# EAGLE design algyan-6th-03 (EAGLE 9.6.2)
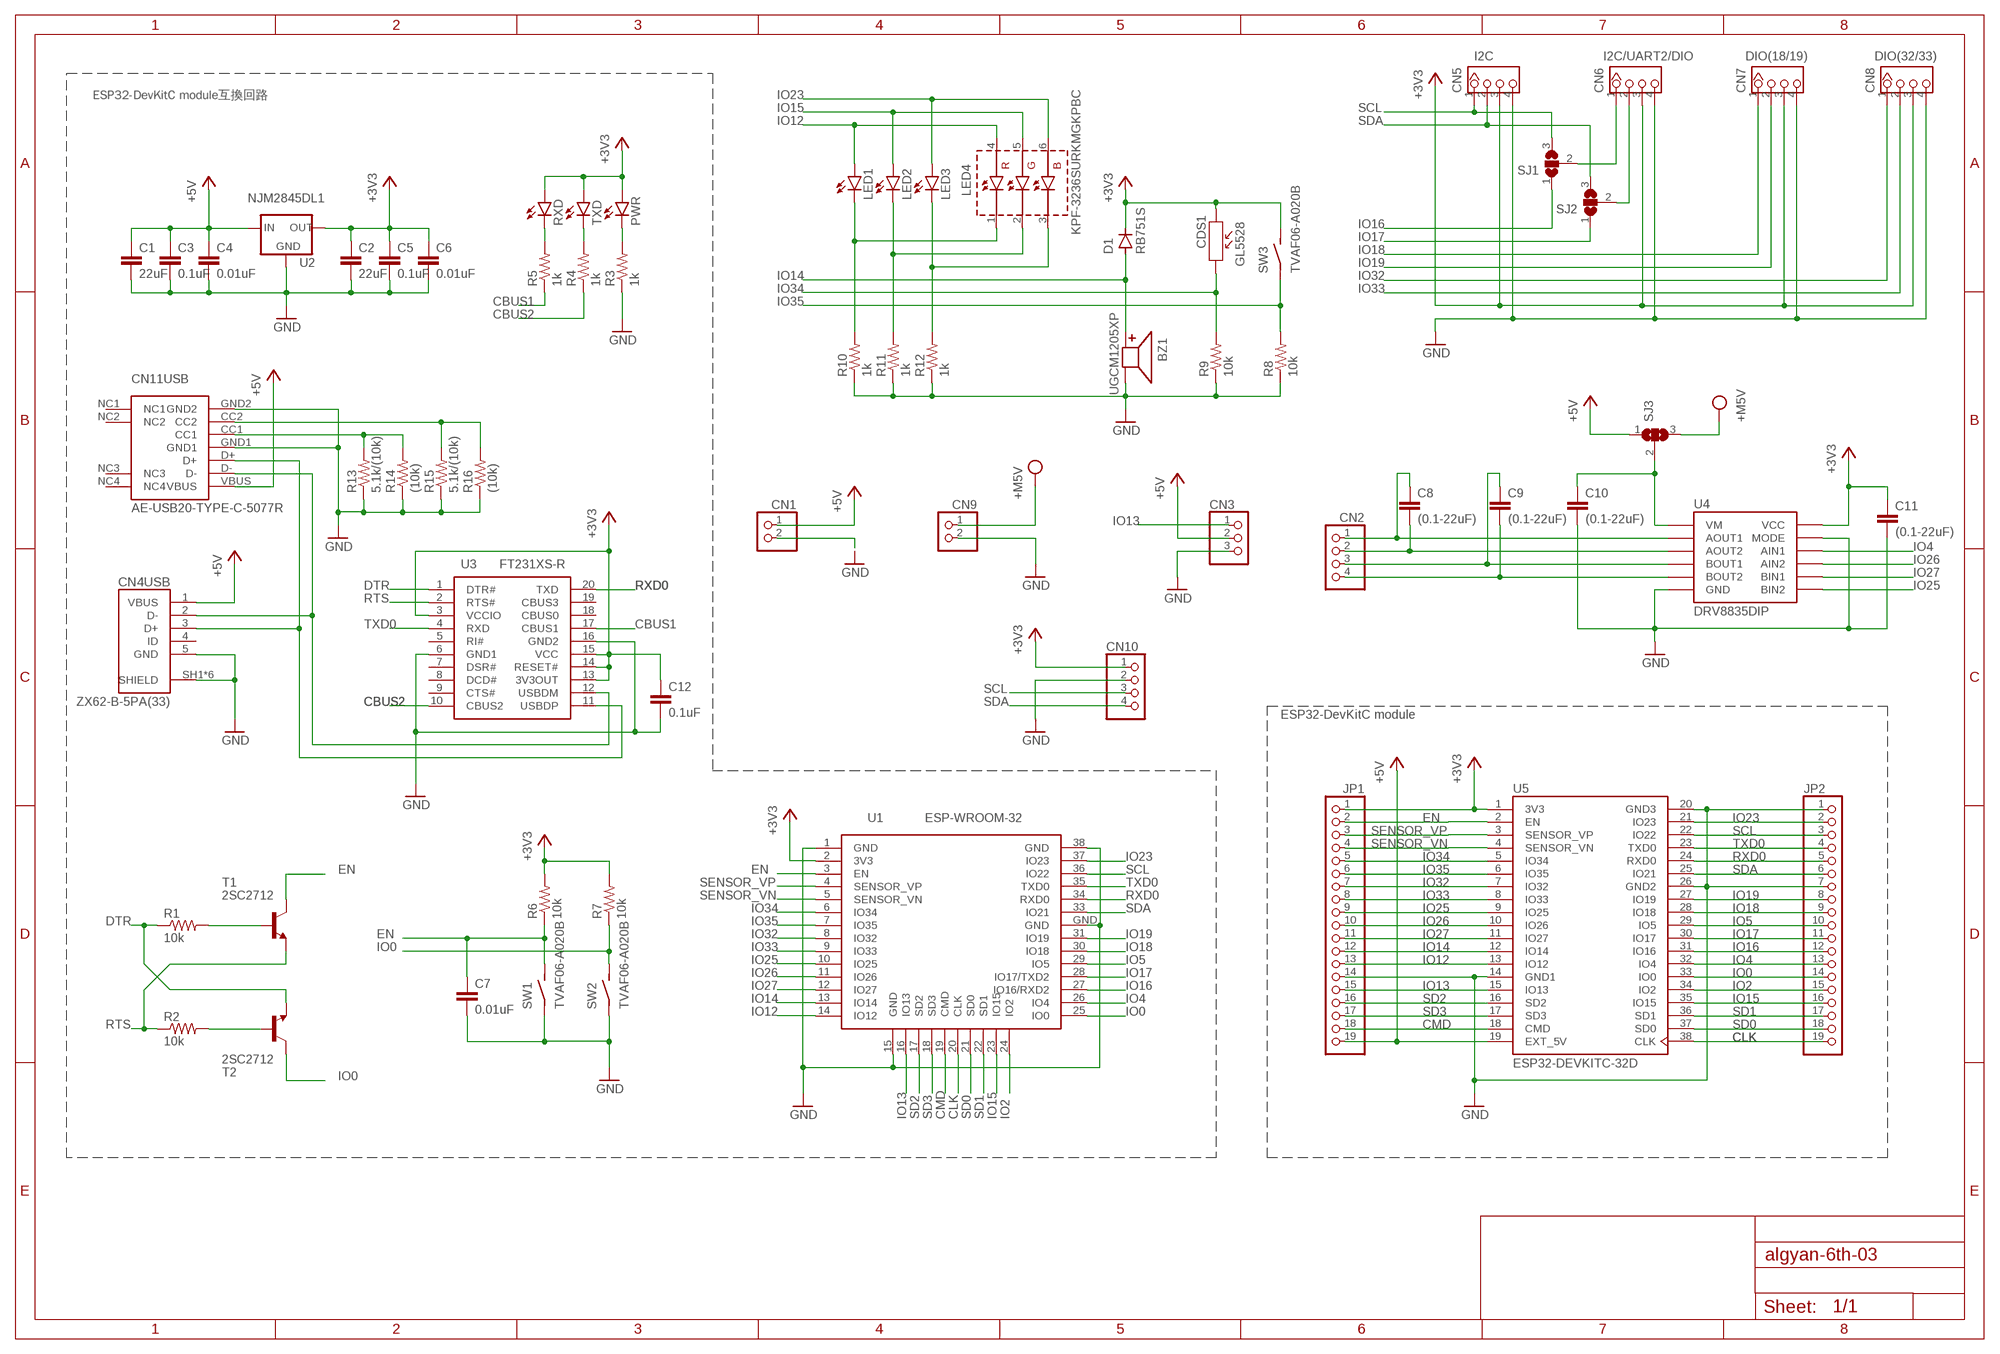
[diagram p0: schematic, sheet 1]

## Parts
BZ1  UGCM1205XP  [UGCM1205XP]
C1  22uF  C-EUC3216  [C3216]
C2  22uF  C-EUC3216  [C3216]
C3  0.1uF  C-EUC2012  [C2012]
C4  0.01uF  C-EUC1608  [C1608]
C5  0.1uF  C-EUC2012  [C2012]
C6  0.01uF  C-EUC1608  [C1608]
C7  0.01uF  C-EUC1608  [C1608]
C8  (0.1-22uF)  C-EUC3216  [C3216]
C9  (0.1-22uF)  C-EUC3216  [C3216]
C10  (0.1-22uF)  C-EUC3216  [C3216]
C11  (0.1-22uF)  C-EUC3216  [C3216]
C12  0.1uF  C-EUC2012  [C2012]
CDS1  GL5528  [GL5528]
CN1  PINHD-1X2  [1X02]
CN2  PINHD-1X4  [1X04]
CN3  PINHD-1X3  [1X03]
CN4USB  ZX62-B-5PA(33)  [HRS_ZX62-B-5PA(33)]
CN5  I2C  GROVE-CONNECTOR-DIP(4P-2.0)  [HW4-2.0]
CN6  I2C/UART2  GROVE-CONNECTOR-DIP(4P-2.0)  [HW4-2.0]
CN7  DIO(18/19)  GROVE-CONNECTOR-DIP(4P-2.0)  [HW4-2.0]
CN8  DIO(32/33)  GROVE-CONNECTOR-DIP(4P-2.0)  [HW4-2.0]
CN9  PINHD-1X2  [1X02]
CN10  PINHD-1X4/90  [1X04/90]
CN11USB  AE-USB20-TYPE-C-5077R  [AE-USB20-TYPE-C-5077R]
D1  RB751S  [SOD-523]
JP1  PINHD-1X19  [1X19]
JP2  PINHD-1X19  [1X19]
LED1  LEDCHIPLED_0805  [CHIPLED_0805]
LED2  LEDCHIPLED_0805  [CHIPLED_0805]
LED3  LEDCHIPLED_0805  [CHIPLED_0805]
LED4  KPF-3236SURKMGKPBC  [KPF-3236SURKMGKPBC]
PWR  LEDCHIPLED_0805  [CHIPLED_0805]
R1  10k  R-US_R2012  [R2012]
R2  10k  R-US_R2012  [R2012]
R3  1k  R-US_R2012  [R2012]
R4  1k  R-US_R2012  [R2012]
R5  1k  R-US_R2012  [R2012]
R6  10k  R-US_R2012  [R2012]
R7  10k  R-US_R2012  [R2012]
R8  10k  R-US_R2012  [R2012]
R9  10k  R-US_R2012  [R2012]
R10  1k  R-US_R2012  [R2012]
R11  1k  R-US_R2012  [R2012]
R12  1k  R-US_R2012  [R2012]
R13  5.1k/(10k)  R-US_R2012  [R2012]
R14  (10k)  R-US_R2012  [R2012]
R15  5.1k/(10k)  R-US_R2012  [R2012]
R16  (10k)  R-US_R2012  [R2012]
RXD  LEDCHIPLED_0805  [CHIPLED_0805]
SJ1  SJ2W  [SJ_2]
SJ2  SJ2W  [SJ_2]
SJ3  SJ2W  [SJ_2]
SW1  TVAF06-A020B  [TVAF06-A020B]
SW2  TVAF06-A020B  [TVAF06-A020B]
SW3  TVAF06-A020B  [TVAF06-A020B]
T1  2SC2712  2SC2712YBC808SOT23-BEC  [SOT23-BEC]
T2  2SC2712  2SC2712YBC808SOT23-BEC  [SOT23-BEC]
TXD  LEDCHIPLED_0805  [CHIPLED_0805]
U1  ESP-WROOM-32  [ESP-WROOM-32]
U2  NJM2845DL1  [D-PAK_TO252AA]
U3  FT231XS-R  [SOP64P599X175-20N]
U4  DRV8835DIP  [DRV8835DIP]
U5  ESP32-DEVKITC-32D  [MODULE_ESP32-DEVKITC-32D]

## Nets
+3V3 [VDD]: C2.1 C5.1 C6.1 C11.1 C12.1 CDS1.1 CN5.3 CN6.3 CN7.3 CN8.3 CN10.1 D1.C JP1.1 PWR.A R6.2 R7.2 RXD.A SW3.2(S) TXD.A U1.2(3V3) U2.3(OUT) U3.3(VCCIO) U3.13(3V3OUT) U3.14(RESET#) U3.15(VCC) U4.VCC U5.1(3V3)
+5V [VDD]: C1.1 C3.1 C4.1 CN1.1 CN3.2 CN4USB.1(VBUS) CN11USB.VBUS JP1.19 SJ3.1 U2.1(IN) U5.19(EXT_5V)
CBUS1: R5.1 U3.17(CBUS1)
CBUS2: R4.1 U3.10(CBUS2)
CLK: JP2.19 U1.20(CLK) U5.38(CLK)
CMD: JP1.18 U1.19(CMD) U5.18(CMD)
DTR: R1.1 T2.E U3.1(DTR#)
EN: C7.1 JP1.2 R6.1 SW1.2(S) T1.C U1.3(EN) U5.2(EN)
GND [GND]: BZ1.P$2 C1.2 C2.2 C3.2 C4.2 C5.2 C6.2 C7.2 C10.2 C11.2 C12.2 CN1.2 CN3.3 CN4USB.5(GND) CN4USB.SH1(SHIELD) CN4USB.SH2(SHIELD) CN4USB.SH3(SHIELD) CN4USB.SH4(SHIELD) CN4USB.SH5(SHIELD) CN4USB.SH6(SHIELD) CN5.4 CN6.4 CN7.4 CN8.4 CN9.2 CN10.2 CN11USB.GND1 CN11USB.GND2 JP1.14 JP2.1 JP2.7 R3.1 R8.1 R9.1 R10.1 R11.1 R12.1 R13.1 R14.1 R15.1 R16.1 SW1.1(P) SW2.1(P) U1.1(GND) U1.15(GND) U1.38(GND) U1.GND U2.4(GND) U3.6(GND1) U3.16(GND2) U4.GND U4.MODE U5.14(GND1) U5.20(GND3) U5.26(GND2)
IO0: JP2.14 R7.1 SW2.2(S) T2.C U1.25(IO0) U5.33(IO0)
IO2: JP2.15 U1.24(IO2) U5.34(IO2)
IO4: JP2.13 U1.26(IO4) U4.AIN1 U5.32(IO4)
IO5: JP2.10 U1.29(IO5) U5.29(IO5)
IO12: JP1.13 LED1.A LED4.4(RA) U1.14(IO12) U5.13(IO12)
IO13: CN3.1 JP1.15 U1.16(IO13) U5.15(IO13)
IO14: BZ1.P$1 D1.A JP1.12 U1.13(IO14) U5.12(IO14)
IO15: JP2.16 LED2.A LED4.5(GA) U1.23(IO15) U5.35(IO15)
IO16: JP2.12 SJ1.1 U1.27(IO16/RXD2) U5.31(IO16)
IO17: JP2.11 SJ2.1 U1.28(IO17/TXD2) U5.30(IO17)
IO18: CN7.1 JP2.9 U1.30(IO18) U5.28(IO18)
IO19: CN7.2 JP2.8 U1.31(IO19) U5.27(IO19)
IO23: JP2.2 LED3.A LED4.6(BA) U1.37(IO23) U5.21(IO23)
IO25: JP1.9 U1.10(IO25) U4.BIN2 U5.9(IO25)
IO26: JP1.10 U1.11(IO26) U4.AIN2 U5.10(IO26)
IO27: JP1.11 U1.12(IO27) U4.BIN1 U5.11(IO27)
IO32: CN8.1 JP1.7 U1.8(IO32) U5.7(IO32)
IO33: CN8.2 JP1.8 U1.9(IO33) U5.8(IO33)
IO34: CDS1.2 JP1.5 R9.2 U1.6(IO34) U5.5(IO34)
IO35: JP1.6 R8.2 SW3.1(P) U1.7(IO35) U5.6(IO35)
N$1: R1.2 T1.B
N$2: R2.2 T2.B
N$3: LED1.C LED4.1(RC) R10.2
N$4: C8.1 CN2.1 U4.AOUT1
N$5: C8.2 CN2.2 U4.AOUT2
N$6: C9.1 CN2.3 U4.BOUT1
N$7: C9.2 CN2.4 U4.BOUT2
N$8: LED2.C LED4.2(GC) R11.2
N$9: LED3.C LED4.3(BC) R12.2
N$10: CN6.2 SJ2.2
N$11: CN6.1 SJ1.2
N$12 [VDD]: C10.1 SJ3.2 U4.VM
N$13: CN11USB.CC1 R13.2 R14.2
N$14: CN11USB.CC2 R15.2 R16.2
N$74: CN4USB.2(D-) CN11USB.D- U3.12(USBDM)
N$81: CN4USB.3(D+) CN11USB.D+ U3.11(USBDP)
N$82: PWR.C R3.2
N$84: R5.2 RXD.C
RTS: R2.1 T1.E U3.2(RTS#)
RXD0: JP2.5 U1.34(RXD0) U3.20(TXD) U5.24(RXD0)
SCL: CN5.1 CN10.3 JP2.3 SJ1.3 U1.36(IO22) U5.22(IO22)
SD0: JP2.18 U1.21(SD0) U5.37(SD0)
SD1: JP2.17 U1.22(SD1) U5.36(SD1)
SD2: JP1.16 U1.17(SD2) U5.16(SD2)
SD3: JP1.17 U1.18(SD3) U5.17(SD3)
SDA: CN5.2 CN10.4 JP2.6 SJ2.3 U1.33(IO21) U5.25(IO21)
SENSOR_VN: JP1.4 U1.5(SENSOR_VN) U5.4(SENSOR_VN)
SENSOR_VP: JP1.3 U1.4(SENSOR_VP) U5.3(SENSOR_VP)
TTXD: R4.2 TXD.C
TXD0: JP2.4 U1.35(TXD0) U3.4(RXD) U5.23(TXD0)
VEE [VDD]: CN9.1 SJ3.3 ; supply symbol labelled +M5V
Unconnected: CN4USB.4(ID) CN11USB.NC1 CN11USB.NC2 CN11USB.NC3 CN11USB.NC4 U3.5(RI#) U3.7(DSR#) U3.8(DCD#) U3.9(CTS#) U3.18(CBUS0) U3.19(CBUS3)

## Notes on the sheet
- ESP32-DevKitC module互換回路
- ESP32-DevKitC module

## Library data of the parts
BZ1 = swest-parts:UGCM1205XP
C1-C12 = rcl:C-EU: CAPACITOR, European symbol; SPICEPREFIX: C
CDS1 = swest-parts:GL5528
CN1 CN9 = pinhead2:PINHD-1X2: PIN HEADER
CN2 CN10 = pinhead2:PINHD-1X4: PIN HEADER
CN3 = pinhead2:PINHD-1X3: PIN HEADER
CN4USB = swest-parts:ZX62-B-5PA(33): ZX Series 5 Position Right Angle PCB Wire Micro B USB Plug Buy Part <https://snapeda.com/parts/ZX62-B-5PA%2833%29/Hirose/view-part/?ref=eda>; ARROW_ELECTRONICS-PURCHASE-URL: https://snapeda.com/shop?store=Arrow+Electronics&id=524781; AVAILABILITY: Good; DESCRIPTION: USB - micro B USB 2.0 Receptacle Connector 5 Position Surface Mount, Right Angle; DIGIKEY-PURCHASE-URL: https://snapeda.com/shop?store=DigiKey&id=524781; MF: Hirose; MOUSER-PURCHASE-URL: https://snapeda.com/shop?store=Mouser&id=524781; MP: ZX62-B-5PA(33); PACKAGE: None; PRICE: None
CN5 = swest-parts:GROVE-CONNECTOR-DIP(4P-2.0): 320110033; CN5: I2C; VALUE: 4P-2.0
CN6 = swest-parts:GROVE-CONNECTOR-DIP(4P-2.0): 320110033; CN6: I2C/UART2/DIO; VALUE: 4P-2.0
CN7 = swest-parts:GROVE-CONNECTOR-DIP(4P-2.0): 320110033; CN7: DIO(18/19); VALUE: 4P-2.0
CN8 = swest-parts:GROVE-CONNECTOR-DIP(4P-2.0): 320110033; CN8: DIO(32/33); VALUE: 4P-2.0
CN11USB = swest-parts:AE-USB20-TYPE-C-5077R
D1 = swest-parts:RB751S
JP1 JP2 = pinhead2:PINHD-1X19: PIN HEADER
LED1-LED3 PWR RXD TXD = swest-parts:LED: LED OSRAM: - CHIPLED LG R971, LG N971, LY N971, LG Q971, LY Q971, LO R971, LY R971 LH N974, LH R974 LS Q976, LO Q976, LY Q976 LO Q996 - Hyper CHIPLED LW Q18S LB Q993, LB Q99A, LB R99A - SideLED LS A670, LO A670, LY A670, LG A670, LP A670 LB A673, LV A673, LT A673, LW A673 LH A674 LY A675 LS A676, LA A676, LO A676, LY A676, LW A676 LS A679, LY A679, LG A679 - Hyper Micro SIDELED® LS Y876, LA Y876, LO Y876, LY Y876 LT Y87S - SmartLED LW L88C, LW L88S LB L89C, LB L89S, LG L890 LS L89K, LO L89K, LY L89K LS L896, LA L896, LO L896, LY L896 - TOPLED LS T670, LO T670, LY T670, LG T670, LP T670 LSG T670, LSP T670, LSY T670, LOP T670, LYG T670 LG T671, LOG T671, LSG T671 LB T673, LV T673, LT T673, LW T673 LH T674 LS T676, LA T676, LO T676, LY T676, LB T676, LH T676, LSB T676, LW T676 LB T67C, LV T67C, LT T67C, LS T67K, LO T67K, LY T67K, LW E67C LS E67B, LA E67B, LO E67B, LY E67B, LB E67C, LV E67C, LT E67C LW T67C LS T679, LY T679, LG T679 LS T770, LO T770, LY T770, LG T770, LP T770 LB T773, LV T773, LT T773, LW T773 LH T774 LS E675, LA E675, LY E675, LS T675 LS T776, LA T776, LO T776, LY T776, LB T776 LHGB T686 LT T68C, LB T68C - Hyper Mini TOPLED® LB M676 - Mini TOPLED Santana® LG M470 LS M47K, LO M47K, LY M47K Source: http://www.osram.convergy.de LUXEON: - LUMILED® LXK2-PW12-R00, LXK2-PW12-S00, LXK2-PW14-U00, LXK2-PW14-V00 LXK2-PM12-R00, LXK2-PM12-S00, LXK2-PM14-U00 LXK2-PE12-Q00, LXK2-PE12-R00, LXK2-PE12-S00, LXK2-PE14-T00, LXK2-PE14-U00 LXK2-PB12-K00, LXK2-PB12-L00, LXK2-PB12-M00, LXK2-PB14-N00, LXK2-PB14-P00, LXK2-PB14-Q00 LXK2-PR12-L00, LXK2-PR12-M00, LXK2-PR14-Q00, LXK2-PR14-R00 LXK2-PD12-Q00, LXK2-PD12-R00, LXK2-PD12-S00 LXK2-PH12-R00, LXK2-PH12-S00 LXK2-PL12-P00, LXK2-PL12-Q00, LXK2-PL12-R00 Source: www.luxeon.com KINGBRIGHT: KA-3528ASYC Source: www.kingbright.com
LED4 = swest-parts:KPF-3236SURKMGKPBC
R1 R2 R6-R9 R13-R16 = resistor:R-US_: RESISTOR, American symbol
R3-R5 R10-R12 = rcl:R-US_: RESISTOR, American symbol; SPICEPREFIX: R
SJ1-SJ3 = jumper:SJ2W: SMD solder JUMPER
SW1-SW3 = swest-parts:TVAF06-A020B
T1 T2 = transistor:2SC2712Y: NPN Transistror BF959 corrected 2008.03.06
U1 = swest-parts:ESP-WROOM-32: Espressif Systems ESP-WROOM-32
U2 = swest-parts:NJM2845DL1
U3 = swest-parts:FT231XS-R: FTDI Chip FT231XS-R, Interface RS232, RS422, RS485, SIE, UART 3MBd, 5 V, 20-pin, SSOP Source: Datasheet <http://uk.rs-online.com/web/p/products/7570032P>; DESCRIPTION: FTDI Chip FT231XS-R, Interface RS232, RS422, RS485, SIE, UART 3MBd, 5 V, 20-pin, SSOP; HEIGHT: 1.7526mm; MANUFACTURER_NAME: FTDI Chip; MANUFACTURER_PART_NUMBER: FT231XS-R; RS_PART_NUMBER: 7570032P
U4 = swest-parts:DRV8835DIP
U5 = swest-parts:ESP32-DEVKITC-32D: Eval Board For Esp-Wroom-32 Buy Part <https://snapeda.com/parts/ESP32-DEVKITC-32D/Espressif%20Systems/view-part/?ref=eda>; AVAILABILITY: Warning; DESCRIPTION: - Transceiver; 802.11 b/g/n (Wi-Fi, WiFi, WLAN), Bluetooth® Smart Ready 4.x Dual Mode For Use With ESP-WROOM-32; DIGIKEY-PURCHASE-URL: https://snapeda.com/shop?store=DigiKey&id=2777395; MF: Espressif Systems; MOUSER-PURCHASE-URL: https://snapeda.com/shop?store=Mouser&id=2777395; MP: ESP32-DEVKITC-32D; PACKAGE: None; PRICE: None

## Net classes
1 GND: width 0.305 mm
2 VDD: width 0.305 mm

## Board
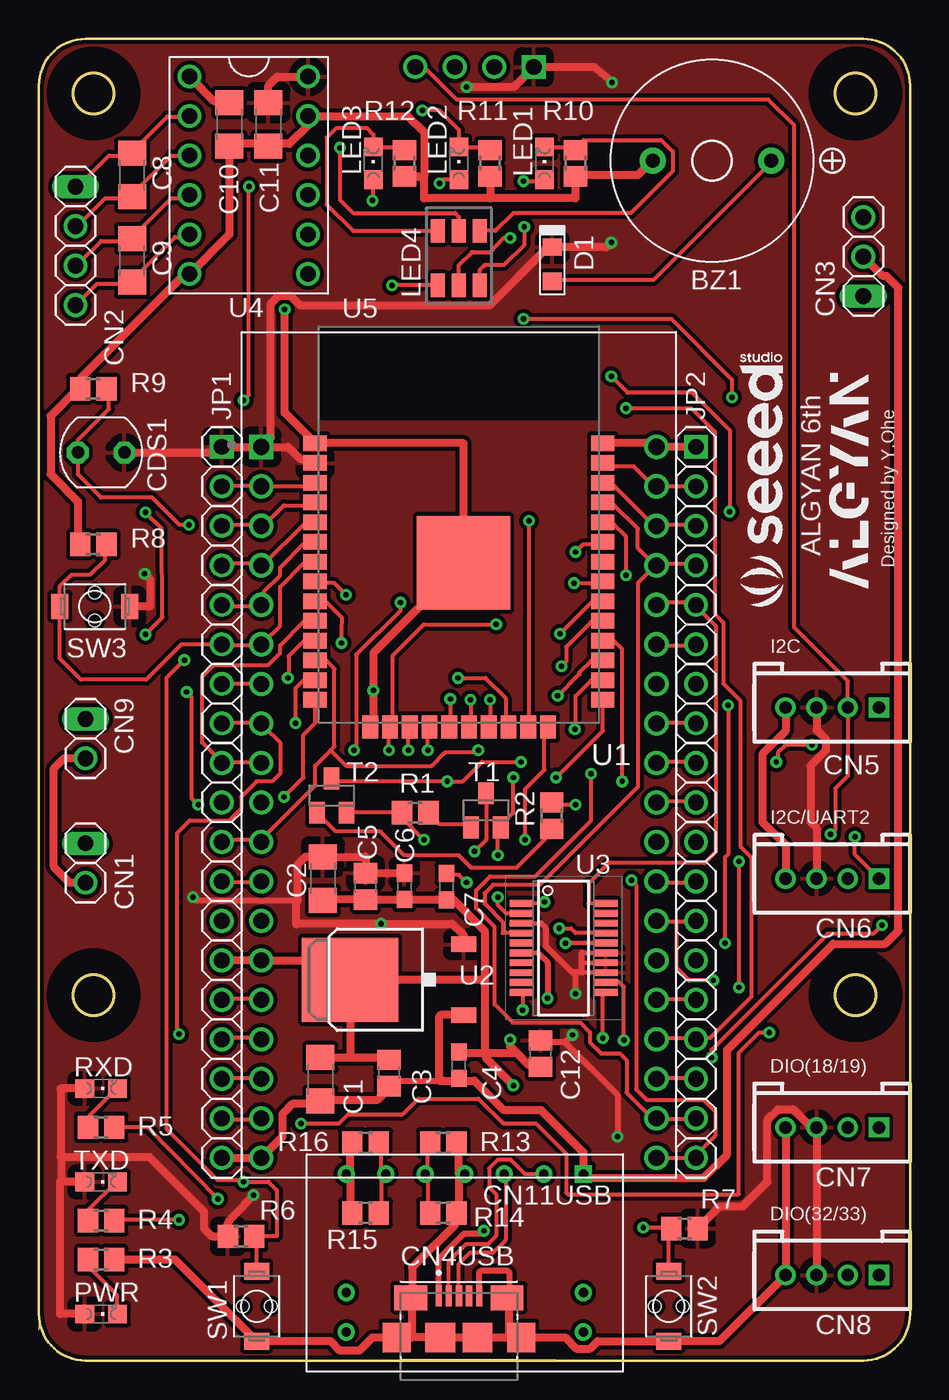
[diagram p1: board, top side]
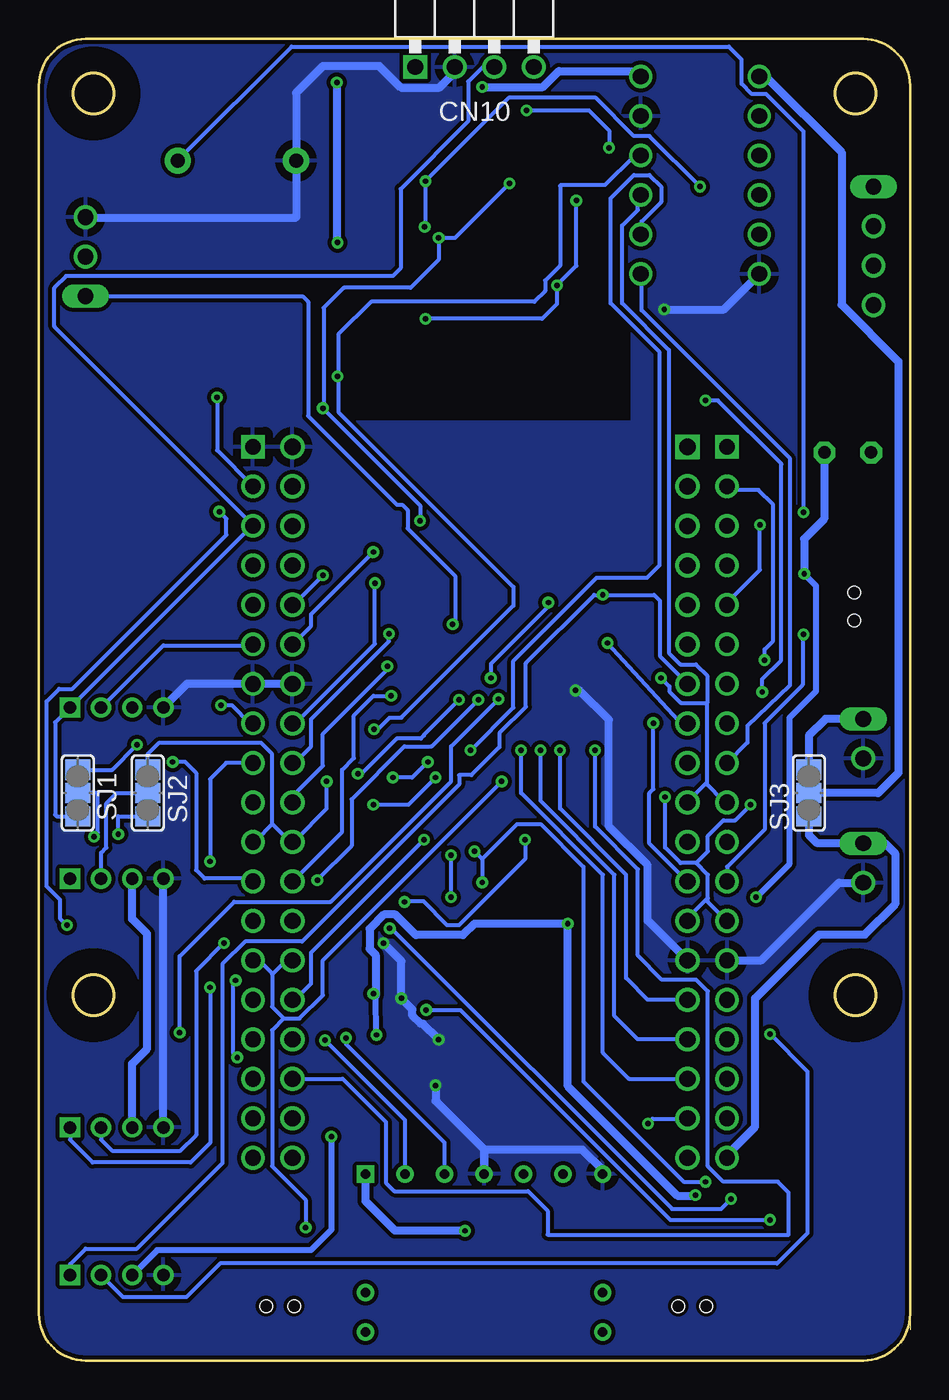
[diagram p2: board, bottom side, seen from below]

Size 56 x 85 mm. Coordinates in mm from the lower left corner, seen from the top.
Outline: 3,0 48,0
Outline: 0,78 0,3
Outline: 0,3 0,2
Outline: 0,3 0,82 arc-90 3,85 53,85 arc-90 56,82 56,3 arc-90 53,0 3,0
Outline: 3,0 arc-90 0,3
Outline: circle at 3.5,81.5 radius 1.3
Outline: circle at 52.5,81.5 radius 1.3
Outline: circle at 52.5,23.5 radius 1.3
Outline: circle at 3.5,23.5 radius 1.3
Copper layers (1*16): Top 0.035mm / dielectric 1.5mm / Bottom 0.035mm
Design rules "default *": minimum track width 10mil, minimum drill 0.35mm, track to track 10mil, track to pad 10mil, pad to pad 6mil, via to via 10mil, smd to smd 6mil, copper to edge 10mil, drill to drill 10mil, minimum pad ring 10mil, minimum via ring 8mil, stop-mask expansion 6mil, vias tented up to drill 0.4mm, thermal gap 20mil
tRestrict: area 1.4,79.3 to 5.7,83.7; area 50.4,79.3 to 54.6,83.7; area 50.4,21.4 to 54.6,25.6; area 1.4,21.4 to 5.7,25.6
bRestrict: area 1.4,79.3 to 5.7,83.7; area 50.4,79.3 to 54.6,83.7; area 50.4,21.4 to 54.6,25.6; area 1.4,21.4 to 5.7,25.6

### Footprints (pad centres in the part's own frame; a part is rotated, then mirrored left to right if it is on the bottom)
UGCM1205XP = drill 0.9 pad 1.676: P$1 0,3.8; P$2 0,-3.8
C3216 = smd 1.6 x 1.8: 1 -1.4,0; 2 1.4,0
C2012 = smd 1.3 x 1.5: 1 -0.85,0; 2 0.85,0
C1608 = smd 1.1 x 1: 1 -0.85,0; 2 0.85,0
GL5528 = drill 0.8 pad 1.4 octagon: 1 -1.5,0; 2 1.5,0
1X02 = drill 1.016 long: 1 -1.27,0 | drill 1.016: 2 1.27,0
1X04 = drill 1.016 long: 1 -3.81,0 | drill 1.016: 2 -1.27,0; 3 1.27,0; 4 3.81,0
1X03 = drill 1.016 long: 1 -2.54,0 | drill 1.016: 2 0,0; 3 2.54,0
HRS_ZX62-B-5PA(33) = smd 0.4 x 1.35: 1 -1.3,2.675; 2 -0.65,2.675; 3 0,2.675; 4 0.65,2.675; 5 1.3,2.675 | smd 2.1 x 1.6: SH1 -3.1,2.55; SH6 3.1,2.55 | smd 1.8 x 1.9: SH2 -4,0; SH5 4,0 | smd 1.9 x 1.9: SH3 -1.2,0; SH4 1.2,0
HW4-2.0 = drill 0.8 pad 1.27 square: 1 -3,0 | drill 0.8 pad 1.27: 2 -1,0; 3 1,0; 4 3,0
1X04/90 = drill 1.016 square: 1 -3.81,-3.81 | drill 1.016: 2 -1.27,-3.81; 3 1.27,-3.81; 4 3.81,-3.81
AE-USB20-TYPE-C-5077R = drill 0.6: CC1 0,10.16; CC2 0,12.7; D+ 0,5.08; D- 0,2.54; GND1 0,7.62; GND2 0,15.24; NC1 -10.16,15.24; NC2 -7.62,15.24; NC3 -10.16,0; NC4 -7.62,0 | drill 0.6 square: VBUS 0,0
SOD-523 = smd 1.1 x 1.2: A 1.1,0; C -1.1,0
1X19 = drill 1.016 square: 1 -22.86,0 | drill 1.016: 2 -20.32,0; 3 -17.78,0; 4 -15.24,0; 5 -12.7,0; 6 -10.16,0; 7 -7.62,0; 8 -5.08,0; 9 -2.54,0; 10 0,0; 11 2.54,0; 12 5.08,0; 13 7.62,0; 14 10.16,0; 15 12.7,0; 16 15.24,0; 17 17.78,0; 18 20.32,0; 19 22.86,0
CHIPLED_0805 = smd 1.2 x 1.2: A 0,-1.05; C 0,1.05
KPF-3236SURKMGKPBC = smd 0.9 x 1.5: 1 -1.35,-1.75; 2 0,-1.75; 3 1.35,-1.75; 4 -1.35,1.75; 5 0,1.75; 6 1.35,1.75
R2012 = smd 1.3 x 1.5: 1 -0.85,0; 2 0.85,0
SJ_2 = smd 1.3 x 1.6: 1 -1.5,0; 2 0,0; 3 1.5,0
TVAF06-A020B = smd 1.1 x 1.6: 1 -2.25,0; 2 2.25,0 | hole 0.8: 0,0.9; 0,-0.9
SOT23-BEC = smd 1 x 1.4: B -0.95,-1.1; C 0,1.1; E 0.95,-1.1
ESP-WROOM-32 = smd 1.5 x 1: 1 -9.25,7; 2 -9.25,5.73; 3 -9.25,4.46; 4 -9.25,3.19; 5 -9.25,1.92; 6 -9.25,0.65; 7 -9.25,-0.62; 8 -9.25,-1.89; 9 -9.25,-3.16; 10 -9.25,-4.43; 11 -9.25,-5.7; 12 -9.25,-6.97; 13 -9.25,-8.24; 14 -9.25,-9.51; 25 9.25,-9.51; 26 9.25,-8.24; 27 9.25,-6.97; 28 9.25,-5.7; 29 9.25,-4.43; 30 9.25,-3.16; 31 9.25,-1.89; 32 9.25,-0.62; 33 9.25,0.65; 34 9.25,1.92; 35 9.25,3.19; 36 9.25,4.46; 37 9.25,5.73; 38 9.25,7 | smd 1 x 1.5: 15 -5.7,-11.25; 16 -4.43,-11.25; 17 -3.16,-11.25; 18 -1.89,-11.25; 19 -0.62,-11.25; 20 0.65,-11.25; 21 1.92,-11.25; 22 3.19,-11.25; 23 4.46,-11.25; 24 5.73,-11.25 | smd 6 x 6: GND 0.3,-0.7
D-PAK_TO252AA = smd 1 x 1.6: 1 -2.28,-4.8; 3 2.28,-4.8 | smd 5.4 x 6.2: 4 0,2.5
SOP64P599X175-20N = smd 1.526 x 0.435: 1 -2.712,2.858; 2 -2.712,2.222; 3 -2.712,1.588; 4 -2.712,0.952; 5 -2.712,0.318; 6 -2.712,-0.318; 7 -2.712,-0.952; 8 -2.712,-1.588; 9 -2.712,-2.222; 10 -2.712,-2.858; 11 2.712,-2.858; 12 2.712,-2.222; 13 2.712,-1.588; 14 2.712,-0.952; 15 2.712,-0.318; 16 2.712,0.318; 17 2.712,0.952; 18 2.712,1.588; 19 2.712,2.222; 20 2.712,2.858
DRV8835DIP = drill 1: AIN1 3.81,0; AIN2 3.81,-2.54; AOUT1 -3.81,2.54; AOUT2 -3.81,0; BIN1 3.81,-5.08; BIN2 3.81,-7.62; BOUT1 -3.81,-2.54; BOUT2 -3.81,-5.08; GND -3.81,-7.62; MODE 3.81,2.54; VCC 3.81,5.08; VM -3.81,5.08
MODULE_ESP32-DEVKITC-32D = drill 1.04 square: 1 -12.7,19.76 | drill 1.04: 2 -12.7,17.22; 3 -12.7,14.68; 4 -12.7,12.14; 5 -12.7,9.6; 6 -12.7,7.06; 7 -12.7,4.52; 8 -12.7,1.98; 9 -12.7,-0.56; 10 -12.7,-3.1; 11 -12.7,-5.64; 12 -12.7,-8.18; 13 -12.7,-10.72; 14 -12.7,-13.26; 15 -12.7,-15.8; 16 -12.7,-18.34; 17 -12.7,-20.88; 18 -12.7,-23.42; 19 -12.7,-25.96; 20 12.7,19.76; 21 12.7,17.22; 22 12.7,14.68; 23 12.7,12.14; 24 12.7,9.6; 25 12.7,7.06; 26 12.7,4.52; 27 12.7,1.98; 28 12.7,-0.56; 29 12.7,-3.1; 30 12.7,-5.64; 31 12.7,-8.18; 32 12.7,-10.72; 33 12.7,-13.26; 34 12.7,-15.8; 35 12.7,-18.34; 36 12.7,-20.88; 37 12.7,-23.42; 38 12.7,-25.96

### Placement (x,y rotation side)
BZ1  43.27,77.16 270 top
C1  18.1,18.1 90 top
C2  18.25,31 270 top
C3  22.5,18.5 90 top
C4  27,19 90 top
C5  21,30.5 270 top
C6  23.5,30.5 270 top
C7  26.2,30.47 270 top
C8  6,76.25 270 top
C9  6,70.75 270 top
C10  12.25,79.5 270 top
C11  14.75,79.5 270 top
C12  32.25,19.75 270 top
CDS1  4,58.4 180 top
CN1  3,32 270 top
CN2  2.35,71.69 270 top
CN3  53,71 90 top
CN4USB  27,1.5 0 top
CN5  51,42 180 top
CN6  51,31 180 top
CN7  51,15 180 top
CN8  51,5.5 180 top
CN9  3,40 270 top
CN10  28,87 0 bottom
CN11USB  35,12 90 top
D1  33,70.5 270 top
JP1  11.76,35.9 270 top
JP2  42.24,35.9 270 top
LED1  32.5,77 0 top
LED2  27,77 0 top
LED3  21.5,77 0 top
LED4  27,70.9 180 top
PWR  4,3 270 top
R1  24.19,35.24 0 top
R2  32.97,35.04 270 top
R3  4,6.5 180 top
R4  4,9 180 top
R5  4,15 180 top
R6  13,8 180 top
R7  41.5,8.5 0 top
R8  3.5,52.5 0 top
R9  3.5,62.5 0 top
R10  34.5,77 90 top
R11  29,77 90 top
R12  23.5,77 90 top
R13  26,14 180 top
R14  26,9.5 180 top
R15  21,9.5 0 top
R16  21,14 0 top
RXD  4,17.5 270 top
SJ1  53.5,36.5 270 bottom
SJ2  49,36.5 270 bottom
SJ3  6.5,36.5 90 bottom
SW1  14,3.5 90 top
SW2  40.5,3.5 90 top
SW3  3.6,48.5 0 top
T1  28.74,35.39 0 top
T2  18.82,36.34 0 top
TXD  4,11.5 270 top
U1  27,52 0 top
U2  22.5,24.5 90 top
U3  33.73,26.54 0 top
U4  13.5,77.5 0 top
U5  27,39 0 top

### Tracks (layer width: path | path; a pad name or v marks a point on that pad's centre or on a via)
+3V3  (via drill 0.35)
  Top 0.305: U3.15 34.9,26.22 | U3.14 34.91,25.59 34.9,25.6 | U3.13 34.9,24.95 | U3.3 32.27,28.13
  Top 0.381: 16.64,29.6 10.1,29.6 v9.9,29.8 | C12.1 32.35,20.49 33.78,20.49 | 33.78,20.49 37.2,17.08 v37.2,14.4 | 33.78,20.49 34.3,20.89 v34.3,20.95 | 32.27,28.13 32.58,27.82 32.58,26.67 34.29,24.95 34.5,24.95 | 34.9,26.22 34.9,25.6 34.9,24.95 34.5,24.95 | v34.5,23.6 34.5,24.95
  Top 0.508: CDS1.1 11.65,58.4 12,58.75 JP1.1 U5.1 | U1.2 17.49,57.99 16.79,57.99 16.02,58.76 U5.1 | U5.1 14.91,59.37 14.91,67.97 15.43,68.49 16.17,68.49 16.76,67.89 29.01,67.89 32.72,71.6 D1.C 36.5,71.6 v36.8,71.9 | v36.85,82.2 36.85,82.23 35.71,83.19 CN10.1 30.52,81.9 v27.5,81.9 | C11.1 14.75,82 15.33,82.58 U4.VCC | CN6.3 50,34.25 49.61,34.63 49.61,38.26 50.59,39.23 50.59,39.97 50,40.55 CN5.3 | CN7.3 50,14.7 | 50,14.7 CN8.3 | PWR.A 1.34,3 1.34,11.5 1.44,11.5 | TXD.A 1.44,11.5 | 1.44,13.1 1.44,11.5 | RXD.A 1.39,17.5 1.39,13.1 1.44,13.1 | 1.44,13.1 7.1,13.1 10.6,9.6 10.6,8.5 11.1,8 R6.2 12.15,8.85 v13.8,10.65 | U2.3 27.3,27.38 26.58,28.1 v22,28.1 16.6,28.1 16.55,28.05 16.55,29.5 16.64,29.6 16.64,31.91 17.13,32.4 C2.1 21,32.4 C5.1 C6.1 | R7.2 43.77,9.91 45.26,9.91 46.84,11.49 46.84,15.48 47.52,16.16 48.48,16.16 49.94,14.7 50,14.7 | v6.8,50.6 7.15,50.25 7.15,48.5 SW3.2
  Bottom 0.381: v9.9,29.8 7.75,31.96 7.75,41.34 6.03,43.06 6.03,49.83 v6.8,50.6 | v37.2,14.4 37.2,8.42 38.52,7.1 48.4,7.1 CN8.3 | v34.3,20.95 34.35,23.45 v34.5,23.6
  Bottom 0.508: v36.85,82.2 36.85,71.95 v36.8,71.9 | v27.5,81.9 23.6,81.9 22.57,82.94 17.66,82.94 U4.VCC | v13.8,10.65 13.85,10.6 14.95,10.6 22,17.65 v22,28.1 28,28.1 28.74,27.36 31.76,27.36 33.08,28.69 33.82,28.69 34.74,27.77 34.74,26.48 34.35,26.1 34.35,23.45 | v6.8,50.6 6.8,52.85 5.51,54.13 5.51,58.39 CDS1.1 | CN7.3 50,19.1 49.05,20.05 49.05,27.45 50,28.4 CN6.3
  pour Top: 2,0 54,0 56,2 56,83 54,85 2,85 0,83 0,2
+5V  (via drill 0.35)
  Top 0.381: CN4USB.1 25.7,6.53 27.32,8.15 28.41,8.15 v28.6,8.35 | C3.1 22.85,18 26,18
  Top 0.508: JP1.19 12,13 14.25,13 U5.19 14.5,13.25 15.65,14.4 15.65,15.85 16.3,16.5 18,16.5 C1.1 18.25,16.75 21.75,16.75 22.5,17.5 C3.1 | U2.1 25.82,22.22 25.75,22.15 25.75,18 26,18 27,18 C4.1 27.25,18 28,18 29.9,16.1 32.3,16.1 35,13.4 CN11USB.VBUS 35,11.75 42.75,11.75 44.25,13.25 44.25,20 51.05,26.8 54.4,26.8 55.25,27.65 55.25,69 54.5,69.75 54.25,69.75 CN3.2
  Bottom 0.508: SJ3.1 6.5,33.8 6,33.3 3,33.3 CN1.1 1.6,33.27 0.95,32.62 0.95,29.35 2.9,27.4 5.85,27.4 9.95,23.3 9.95,15.05 11.75,13.25 JP1.19 | v28.6,8.35 33.1,8.35 35,10.25 CN11USB.VBUS
CBUS1  (via drill 0.35)
  Top 0.254: R5.1 7,15 v11.5,10.4 | v33.45,27.8 34.2,27.8 34.5,27.5 36.25,27.5 U3.17
  Bottom 0.254: v11.5,10.4 12.15,9.75 15.3,9.75 33.35,27.8 v33.45,27.8
CBUS2  (via drill 0.35)
  Top 0.254: v9,9.05 4.9,9.05 R4.1 | v31.1,22.55 31.1,23.62 U3.10
  Bottom 0.254: v31.1,22.55 28.9,22.55 15.4,9.05 v9,9.05
CLK  (via drill 0.35)
  Top 0.254: v27.75,42.5 27.75,40.75 U1.20 | v38.1,30.9 38.4,30.6 38.4,17.45 39.1,16.75 42.75,16.75 43.5,16 43.5,14.5 42.25,13.25 JP2.19 42,13 39.75,13 U5.38
  Bottom 0.254: v27.75,42.5 30.75,39.5 32.5,39.5 35.9,36.1 35.9,33.1 v38.1,30.9
CMD  (via drill 0.35)
  Top 0.254: v26.45,42.55 26.45,40.75 U1.19 | v46.95,21.1 46.3,21.1 45,19.8 45,10.7 34,10.7 33.9,10.8 33.9,13.3 31.95,15.25 29.85,15.25 28.25,16.85 24.4,16.85 23.4,15.85 19.9,15.85 19.3,15.25 v16.85,15.25 | JP1.18 12,15.5 14.25,15.5 U5.18
  Bottom 0.254: v26.45,42.55 29.5,39.5 29.5,37.25 37.25,29.5 43.45,29.5 46.95,26 v46.95,21.1 | v16.85,15.25 16.55,15.55 14.33,15.55 U5.18
DTR  (via drill 0.35)
  Top 0.254: T2.E 20,35.25 23.25,35.25 R1.1 23.25,35 v24.75,33.5 | v32.5,29.5 32.4,29.4 U3.1
  Bottom 0.254: v32.5,29.5 32.45,29.55 31.3,29.55 29.75,28 29,28 24.75,32.25 v24.75,33.5
EN  (via drill 0.35)
  Top 0.254: U1.3 17.75,56.25 14.5,56.25 U5.2 14.25,56.25 12,56.25 JP1.2 | SW1.2 14,8 | v27.5,30.75 27,31.25 26.25,31.25 C7.1 | v28,32.75 28.75,33.5 28.75,36.25 T1.C | 14,8 15.3,8 15.3,10.95 14.75,11.5 v13.15,11.5 13.05,11.6 11.5,11.6 8.2,14.9 8.2,43.9 v9.35,45.05 | 14,8 R6.1
  Bottom 0.254: 27.5,32.25 v27.5,30.75 | v28,32.75 27.5,32.25 | v13.15,11.5 14.55,11.5 21,17.95 21,31.75 23.75,34.5 25.25,34.5 27.5,32.25 | JP1.2 11.75,56 9.75,56 8.8,55.05 8.8,46.28 9.35,45.73 v9.35,45.05
GND  (via drill 0.35)
  Top 0.305: U3.16 v33.86,26.86 | U3.6 32.08,26.22
  Top 0.381: v32.7,23.3 32.7,25.6 32.08,26.22 | CN4USB.5 28.3,5.65 28.45,5.8 30.1,5.8 30.25,5.65 30.25,4 | v33.86,26.86 v33.85,26.85
  Top 0.508: U1.15 21.5,40.75 v21.5,43.1 21.5,45.5 U1.GND 27.3,59 U1.1 15.8,60.95 v15.8,67.6 | C1.2 20,19.5 | 20,19.5 22.5,19.5 C3.2 | 20,19.5 U2.4 19.96,24.71 | 30.75,19.75 28.75,19.75 | 28.75,19.75 28.65,19.75 | 28.65,19.75 27,19.75 C4.2 | 30.75,19.75 31.5,19 32.25,19 C12.2 | C2.2 18.25,29.65 C5.2 C6.2 26.15,29.65 C7.2 26.68,29.62 28.65,27.65 28.65,24.5 | 28.65,24.5 28.65,19.75 | R3.1 8.75,6.5 SW1.1 18.75,1.25 19.35,0.65 20.6,0.65 21.45,1.5 CN4USB.SH2 24,1.5 | 24,1.5 CN4USB.SH3 CN4USB.SH4 CN4USB.SH5 | 24,1.5 24,4 CN4USB.SH1 24,4.25 24,6 26.75,8.75 26.75,9.25 R14.1 27,9.5 27,11.75 27.25,12 CN11USB.GND1 27,12 27,14 R13.1 | CN4USB.SH6 30.25,4 30.25,1.75 CN4USB.SH5 | R8.1 2.5,52.5 2.5,55.25 0.75,57 0.75,60.75 2.5,62.5 R9.1 2.75,62.75 2.75,63.25 9.5,70 U4.GND 12.25,72.44 C10.2 12.25,78.25 14.75,78.25 C11.2 15,78.25 16.1,78.25 17.31,79.46 U4.MODE 23.73,80.04 24.76,79.01 24.76,76.15 R12.1 24.75,76.15 24.75,74.75 29,74.75 | R15.1 20,9.5 20,12 CN11USB.GND2 20,12.25 20,14 R16.1 | U1.38 39.5,59 U5.20 JP2.1 | BZ1.P$2 39.25,77 38.5,76.25 34.5,76.25 R10.1 34.5,74.75 29,74.75 | R11.1 29,74.75 | 19.96,24.71 19.75,25.75 14.5,25.75 U5.14 JP1.14 | CN5.4 48,40.5 46.51,39.01 46.51,34.63 48,33.15 CN6.4 | CN7.4 CN8.4 43.75,1.25 SW2.1 35.91,1.25 35.44,0.78 34.56,0.78 33.84,1.5 CN4USB.SH5 | 28.65,24.5 20.17,24.5 19.96,24.71 | 28.75,19.75 28.75,19.45 v30.5,17.7 | CN1.2 1.98,30.73 0.97,31.74 0.97,38.1 1.6,38.73 CN9.2 | 30.75,19.75 30.3,20.2 v30.3,20.65
  Bottom 0.508: v15.8,67.6 11.97,67.6 U4.GND | CN3.3 52.97,73.51 39.47,73.51 BZ1.P$2 39.47,81.53 37.75,83.25 34.11,83.25 32.72,81.86 30.25,81.86 29.27,82.84 CN10.2 | U5.26 JP2.7 46.48,43.52 CN5.4 | U5.14 16.86,28.3 16.86,31.86 19.36,34.36 19.36,41.22 21.25,43.1 v21.5,43.1 | v30.5,17.7 30.5,16.7 27.38,13.58 CN11USB.GND1 27.38,13.56 21.06,13.56 19.76,12.26 CN11USB.GND2 | JP1.14 9.56,25.74 4.57,30.73 CN1.2 | CN7.4 CN6.4 | v30.3,20.65 31.31,21.66 31.47,21.66 31.99,22.18 31.99,22.59 v32.7,23.3 32.7,25.7 v33.85,26.85
  pour Bottom: 1,1 2,0 54,0 56,2 56,83 54,85 2,85 0,83 0,2
IO0  (via drill 0.35)
  Top 0.254: SW2.2 40.5,8.5 R7.1 40.6,8.55 v38.85,8.55 | T2.C 19,37.25 v26.25,37.25 27.25,37.25 28.5,38.5 v31,38.5 | U1.25 36.25,40.5 v33.25,37.5
  Bottom 0.254: v26.25,37.25 37.75,25.75 37.75,23.5 39.25,22 40.25,22 | 40.25,22 41,22.75 41,24.85 | 41,24.85 41,24.9 41.84,25.74 JP2.14 | v33.25,37.5 32,37.5 v31,38.5 | v38.85,8.55 38.85,10.35 41,12.5 41,21.25 40.25,22 | 41,24.85 40.11,25.74 U5.33
IO2  (via drill 0.35)
  Top 0.254: v31.25,33.5 31.25,36.75 32.5,38 32.5,40.75 U1.24 | JP2.15 42,23.25 39.75,23.25 U5.34
  Bottom 0.254: v31.25,33.5 38.5,26.25 38.5,24.25 39.5,23.25 U5.34
IO4  (via drill 0.35)
  Top 0.254: 41,28.25 39.75,28.25 U5.32 | 41,28.25 42,28.25 JP2.13 | v34.45,40.6 34.5,40.65 34.5,42.75 35.5,43.75 U1.26 | 41,28.25 41,25.25 41.8,24.45 v43.35,24.45 | v43.25,19.5 43.25,20 50.7,27.45 53.65,27.45 v54.2,28 | v44.4,54.6 44.4,59.85 42,62.25 37.85,62.25 v36.8,63.3
  Bottom 0.254: 36.75,63.3 36.75,66 34.65,68.1 24.15,68.1 23.46,68.79 23.46,69.46 22.5,70.42 22.5,75.55 22.45,75.6 19.61,75.6 17.71,77.5 U4.AIN1 | 36.75,63.3 36.75,61 25.5,49.75 25.5,48.55 32.7,41.35 33.45,41.35 34.2,40.6 v34.45,40.6 | v43.35,24.45 43.5,24.3 43.5,19.75 v43.25,19.5 | v54.2,28 54.65,28.45 54.65,29.65 55.5,30.5 55.5,42.4 54.7,43.2 53.85,43.2 43.95,53.1 43.95,54.15 v44.4,54.6 | 36.75,63.3 v36.8,63.3
IO5  (via drill 0.35)
  Top 0.254: v33.6,44.65 33.9,44.95 33.9,45.9 35.5,47.5 36.25,47.5 U1.29 | JP2.10 42,36 39.75,36 U5.29
  Bottom 0.254: v33.6,44.65 33.6,44.45 37.75,40.3 37.75,38.25 39.5,36.5 39.5,36 U5.29
IO12  (via drill 0.35)
  Top 0.254: v31.15,75.85 32.5,75.85 LED1.A | v31.2,72.9 31.2,71.75 29.9,70.45 28.65,70.45 28.35,70.15 LED4.4 | U1.14 17.75,41 17,40.25 17,37.5 v15.75,36.25 | v13.15,61.75 13.5,62.1 v13.5,75.5 | v9.5,43 9.8,42.7 9.8,36.2 v10.25,35.75
  Bottom 0.254: v31.2,72.9 31.15,72.95 v31.15,75.85 25.8,81.2 20.2,81.2 17.75,78.75 16.75,78.75 v13.5,75.5 | v15.75,36.25 15.75,33 14.75,32 13.75,32 | 13.75,32 13,31.25 13,29.75 | 13,29.75 13,29.5 12,28.5 JP1.13 | 13,29.75 14.25,28.5 U5.13 | v10.25,35.75 11.25,34.75 12,34.75 13,33.75 13,32.75 13.75,32 | v9.5,43 9.5,43.83 8.29,45.03 8.29,57.61 8.25,57.65 12.35,61.75 v13.15,61.75
IO13  (via drill 0.35)
  Top 0.254: v22.5,39.25 22.5,40.75 U1.16 22.75,40.75 22.75,45.35 24.75,47.35 v29.4,47.35 | JP1.15 12,23.25 14.25,23.25 U5.15
  Bottom 0.254: v22.5,39.25 22.5,35.5 18.25,31.25 18.25,24.6 16.85,23.2 U5.15 | v29.4,47.35 29.25,47.5 29.25,50.47 32.29,53.51 32.29,54.69 32.65,55.05 32.99,55.05 38.69,60.75 38.69,68.09 39.05,68.45 CN3.1
IO14  (via drill 0.35)
  Top 0.254: v16.5,41 16.5,43.25 17,43.75 U1.13 | JP1.12 12,30.75 14.25,30.75 U5.12 | D1.A 33,69.5 39.5,69.5 47,77 BZ1.P$1 | v6.85,46.7 7.94,47.79 7.89,53.51 v6.85,54.55
  Bottom 0.254: v16.5,41 16.5,36.75 16.75,36.5 16.75,33.25 14.5,31 U5.12 | v6.85,46.7 6.9,46.65 6.9,43.45 9.35,41 9.35,34.15 11.75,31.75 11.75,31 JP1.12 | v6.85,54.55 6.85,79.05 9.24,81.44 10.16,81.44 10.82,82.11 10.82,83.67 11.65,84.5 39.75,84.5 47,77.25 BZ1.P$1
IO15  (via drill 0.35)
  Top 0.254: U5.35 39.75,20.75 42,20.75 JP2.16 42.25,20.75 43.15,20.75 45.8,23.4 45.8,32.37 45.1,33.07 45.1,42.45 44.01,43.54 44.01,47.46 43.45,48.02 43.45,59.75 41.95,61.25 v37.75,61.25 | LED2.A 26,75.95 v25.75,75.7 | v30.3,72.2 29.9,72.2 29,71.3 27.85,71.3 27,70.45 LED4.5 | v31.5,54 31.5,40.75 U1.23
  Bottom 0.254: v25.75,75.7 29.25,72.2 v30.3,72.2 30.3,70.8 32.1,69 36.4,69 37.7,67.7 37.7,61.3 v37.75,61.25 31.5,55 v31.5,54
IO16  (via drill 0.35)
  Top 0.254: v49.7,39.6 48,39.6 47.5,39.1 47.5,38.6 v47.4,38.5 | v33.35,42.75 34.75,44.15 34.75,44.25 35.5,45 36.25,45 U1.27 | JP2.12 42,30.75 39.75,30.75 U5.31
  Bottom 0.254: v49.7,39.6 51.3,38 SJ1.1 | v47.4,38.5 46.6,38.5 45.9,37.8 45.9,31.55 45.35,31 42.25,31 JP2.12 | v33.35,42.75 34.5,42.75 35.75,41.5 35.75,38.75 36.5,38 36.5,34 39.5,31 U5.31
IO17  (via drill 0.35)
  Top 0.254: v37.5,37.25 37.5,45.75 37,46.25 36.25,46.25 U1.28
  Bottom 0.254: SJ2.1 49,39 48.25,39.75 41.75,39.75 41,39 41,34.5 | 41,34.5 42,33.5 JP2.11 | v37.5,37.25 37.5,35.5 39.5,33.5 U5.30 39.75,33.25 41,34.5
IO18  (via drill 0.35)
  Top 0.254: v33.5,46.75 35.5,48.75 36.25,48.75 U1.30 | v45,32.1 v45,24 | U5.28 39.75,38.5 42,38.5 JP2.9
  Bottom 0.254: v33.5,46.75 33.5,46.25 38.5,41.25 38.5,39.5 39.5,38.5 U5.28 | CN7.1 54,14.2 52.55,12.75 46.25,12.75 45,14 v45,24 | v45,32.1 45,37.4 43.96,38.44 JP2.9
IO19  (via drill 0.35)
  Top 0.254: v34.4,50 34.5,49.94 34.92,50 36.25,50 U1.31 | v44.1,26.85 44.1,32.35 44.3,32.55 v44.3,42.15 | U5.27 39.75,41 42,41 JP2.8
  Bottom 0.254: v34.4,50 34.4,46.1 39.5,41 U5.27 | CN7.2 52,14.2 51.3,13.5 46.9,13.5 45.9,14.5 45.9,25.05 v44.1,26.85 | v44.3,42.15 43.6,42.15 42.43,40.98 JP2.8
IO23  (via drill 0.35)
  Top 0.254: U1.37 36.25,57.5 38.25,57.5 39.5,56.25 U5.21 39.75,56.25 42,56.25 JP2.2 | LED3.A 21.45,75.9 v21.45,74.6 | LED4.6 v22.7,69.15 | v44.55,61.95 44.55,63.1 40.65,67 v31.15,67
  Bottom 0.254: v21.45,74.6 21.45,70.4 v22.7,69.15 22.7,67.95 23.65,67 v31.15,67 | v44.55,61.95 44.55,58.55 42.25,56.25 JP2.2
IO25
  Top 0.254: U1.10 17.75,47.5 17,47.5 15.5,46 15.5,45.5 14.75,44.75 11.25,44.75 10.5,44 10.5,39.75 11.75,38.5 JP1.9 12,38.5 14.25,38.5 U5.9
  Bottom 0.254: JP1.9 10.46,39.74 10.46,40.81 7.7,43.44 7.7,58 17.25,67.55 17.25,69.75 U4.BIN2
IO26  (via drill 0.35)
  Top 0.254: v16,43.9 16.05,43.95 16.05,45.3 17,46.25 17.75,46.25 U1.11
  Bottom 0.254: 13.05,37.2 13.05,37.05 12,36 JP1.10 | 13.05,37.2 13.05,42.3 | U4.AIN2 17.5,74.75 17.5,74 18.5,73 18.5,68 15.5,65 15.5,45.52 14.76,44.78 13.77,44.78 13.05,44.06 13.05,42.3 | 13.05,37.2 14.25,36 U5.10 | v16,43.9 15.46,43.36 15.46,43.04 14.72,42.3 13.05,42.3
IO27  (via drill 0.35)
  Top 0.254: 18.75,39.25 17.75,38.25 17.75,37 14.25,33.5 | 18.75,39.25 19,39.5 19,44.5 18.5,45 17.75,45 U1.12 | v28.25,39.25 28.1,39.1 26.1,39.1 25.25,38.25 19.75,38.25 18.75,39.25 | 14.25,33.5 12,33.5 JP1.11 | 14.25,33.5 U5.11
  Bottom 0.254: v28.25,39.25 25.5,42 25.5,45 20.15,50.35 16.9,50.35 16.1,51.15 16.1,64.85 19.25,68 19.25,74.75 17.75,76.25 16.75,76.25 16,75.5 16,74.5 17.25,73.25 17.25,72.5 U4.BIN1
IO32  (via drill 0.35)
  Top 0.254: v19.75,49.25 19,50 17.75,50 U1.8 | JP1.7 12,43.5 14.25,43.5 U5.7
  Bottom 0.254: U5.7 14.5,43.75 16.07,45.33 16.07,48.88 16.45,49.25 v19.75,49.25 20.3,49.25 24.7,44.85 24.7,42.05 26.4,40.35 26.4,39.45 28.2,37.65 28.99,37.65 28.99,37.04 39.08,26.95 42.75,26.95 44.2,25.5 44.2,12.7 49.7,7.2 53,7.2 54,6.2 CN8.1
IO33  (via drill 0.35)
  Top 0.254: v19.45,46.15 19.5,47.75 18.5,48.75 17.75,48.75 U1.9 | v9,21 8.9,21.1 8.9,33.95 9.7,34.75 12.25,34.75 13,35.5 13,36.25 14,37.25 15,37.25 15.5,37.75 15.5,39.75 14.5,40.75 U5.8 14.25,41 12,41 JP1.8
  Bottom 0.254: v19.45,46.15 14.5,40.75 U5.8 | CN8.2 50.6,4.1 46.5,4.1 44.35,6.25 8.55,6.25 6.6,8.2 6.6,18.6 v9,21
IO34  (via drill 0.35)
  Top 0.254: R9.2 4.5,62.5 4.5,61.2 2.5,59.2 CDS1.2 2.5,57 4,55.5 7.3,55.5 9.05,53.75 v9.65,53.75 | U1.6 17.75,52.5 17,52.5 15.5,51 15.5,50.5 14.5,49.5 14.5,48.75 U5.5 14.25,48.5 12,48.5 JP1.5
  Bottom 0.254: v9.65,53.75 9.65,50.85 11.75,48.75 JP1.5
IO35
  Top 0.254: R8.2 4.25,52.5 4.25,51.5 3.3,50.55 2.1,50.55 1.35,49.8 SW3.1 1.35,45.15 2.7,43.8 6.9,43.8 9.16,46.06 JP1.6 12,46 14.25,46 U5.6 14.5,46.25 15.5,47.25 15.5,49.75 17,51.25 17.75,51.25 U1.7
N$1
  Top 0.254: T1.B 27.75,34.5 25.75,34.5 25.25,35 R1.2
N$2
  Top 0.254: T2.B 19.07,34.04 21.96,34.04 23.5,32.5 27,32.5 27.8,31.7 30.7,31.7 33,34 R2.2
N$3
  Top 0.254: 34.5,78 32.5,78 LED1.C | 34.5,78 35,78.5 40,78.5 40.75,77.75 40.75,76.5 38.05,73.8 30.5,73.8 29.35,72.65 LED4.1 | 34.5,78 R10.2
N$4
  Top 0.254: CN2.1 2.5,75.5 4.5,77.5 6,77.5 C8.1 6,77.75 8.25,80 9.5,80 U4.AOUT1
N$5
  Top 0.254: CN2.2 2.5,73 4.25,74.75 6,74.75 C8.2 6,75 8.5,77.5 U4.AOUT2
N$6
  Top 0.254: CN2.3 2.5,70.5 4,72 6,72 C9.1 6,72.25 8.5,74.75 9.5,74.75 U4.BOUT1
N$7
  Top 0.254: CN2.4 2.5,68 3.75,69.25 6,69.25 C9.2 6,69.5 8.75,72.25 9.5,72.25 U4.BOUT2
N$8  (via drill 0.35)
  Top 0.254: R11.2 29,78 27,78 LED2.C 27,79.15 25.75,80.4 v24.65,80.4 | LED4.2 27,73.55 26.75,73.8 20.2,73.8 19.35,74.65 v19.35,78
  Bottom 0.254: v24.65,80.4 20.65,80.4 19.35,79.1 v19.35,78
N$9
  Top 0.254: R12.2 23.5,78 21.5,78 LED3.C 21.5,78.85 21.1,79.25 19.1,79.25 18.5,78.65 18.5,74.35 20.2,72.65 LED4.3
N$10
  Bottom 0.254: SJ2.2 51,36.5 51.66,35.84 51.66,32.99 52,32.65 CN6.2
N$11  (via drill 0.35)
  Top 0.254: v52.45,33.7 52.45,32.55 CN6.1
  Bottom 0.254: SJ1.2 52.2,36.5 52.2,33.95 v52.45,33.7
N$12
  Top 0.508: C10.1 12.25,81 11.25,81 9.75,82.5 U4.VM
  Bottom 0.508: U4.VM 9.28,82.58 4.4,77.7 4.4,67.9 0.75,64.25 0.75,37.8 2.05,36.5 SJ3.2
N$13
  Top 0.254: 25,12 25,9.5 R14.2 | 25,12 25,14 R13.2 | 25,12 CN11USB.CC1
N$14
  Top 0.254: 22,11.75 22,9.5 R15.2 | 22,11.75 22.25,12 CN11USB.CC2 22,11.75 | 22,11.75 22,14 R16.2
N$74  (via drill 0.35)
  Top 0.254: CN4USB.2 26.35,6.38 27.45,7.47 28.85,7.47 29.4,8.03 29.4,10.7 28.95,11.15 28.95,12.35 29.53,12.94 30.31,12.94 31.24,12 CN11USB.D- | v37.6,20.6 37.6,24.04 37.29,24.35 36.48,24.35 U3.12
  Bottom 0.254: CN11USB.D- 32.46,15.46 v37.6,20.6
N$81  (via drill 0.35)
  Top 0.254: CN4USB.3 27,6.22 27.7,6.92 29.18,6.92 30,7.75 30,11.92 CN11USB.D+ | v36.25,20.75 36.25,23.5 U3.11
  Bottom 0.254: v36.25,20.75 36.25,20.35 29.92,14.02 CN11USB.D+
N$82
  Top 0.254: PWR.C 5,3 5,4.25 3.25,6 3.25,6.5 R3.2
N$84
  Top 0.254: RXD.C 5,17.5 3.25,15.75 3.25,15 R5.2
RTS  (via drill 0.35)
  Top 0.254: 33.5,35.75 33,35.75 R2.1 33.5,35.75 | v29.5,32.5 29.5,34.25 T1.E 29.75,34.5 30.5,35.25 v30.5,37.5 | v29.5,29.8 29.5,29.3 30.05,28.75 31,28.75 U3.2 | v34.5,35.75 33.5,35.75
  Bottom 0.254: v29.5,29.8 v29.5,32.5 | v34.5,35.75 32.25,35.75 v30.5,37.5
RXD0  (via drill 0.35)
  Top 0.254: v37.75,50.5 37.75,53 37,53.75 36.25,53.75 U1.34 | U3.20 35.34,29.4 35.34,30.7 36.64,32 42.8,32 43.5,32.7 43.5,47.25 42.25,48.5 JP2.5 42,48.75 39.75,48.75 U5.24
  Bottom 0.254: v37.75,50.5 39.5,48.75 U5.24
SCL
  Top 0.254: U1.36 36.25,56.25 37,56.25 39.5,53.75 U5.22 39.75,53.75 42,53.75 JP2.3
  Bottom 0.254: CN10.3 27.47,83.19 28.4,82.25 28.4,79.7 | 42.25,53.75 55,66.5 55,69 54.25,69.75 33.25,69.75 32.75,70.25 32.75,75.35 28.4,79.7 | 42.25,53.75 CN5.1 54.95,41.05 54.95,35.1 54.85,35 SJ1.3 | 42.25,53.75 JP2.3 | 28.4,79.7
SD0  (via drill 0.35)
  Top 0.254: v29,42.5 29,40.75 U1.21 | v35.5,37.75 35.5,34.75 31.9,31.15 29,31.15 28.1,30.25 28.1,29.1 29.3,27.9 29.3,22.9 30.45,21.75 34.8,21.75 35.42,21.12 35.42,20.48 36.15,19.75 37.35,19.75 37.77,19.32 37.77,17.23 39.42,15.58 U5.37 39.72,15.55 42.15,15.55 JP2.18
  Bottom 0.254: v35.5,37.75 35.25,37.75 32.99,40.01 31.44,40.01 31.25,40.2 31.25,40.25 v29,42.5
SD1  (via drill 0.35)
  Top 0.254: v26.95,43.9 28.7,43.9 30,42.6 30,40.75 U1.22 | v23.25,48.75 23.25,48.25 20.4,45.4 20.4,39.4 v20.25,39.25 | U5.36 39.73,18.15 42.21,18.15 JP2.17
  Bottom 0.254: v26.95,43.9 26.95,44.8 23.25,48.5 v23.25,48.75 | v20.25,39.25 20.25,34.35 17.5,31.6 17.5,26.05 15.95,24.5 13.75,24.5 13,23.75 13,12.5 12,11.5 8.5,11.5 7.8,10.8 7.8,8.1 23.3,8.1 23.3,9.65 24.55,10.9 33.15,10.9 33.7,11.45 33.7,15.35 36.47,18.12 U5.36
SD2  (via drill 0.35)
  Top 0.254: v23.75,39.25 23.75,40.75 U1.17 | JP1.16 12,20.75 14.25,20.75 U5.16
  Bottom 0.254: v23.75,39.25 23.75,36 19,31.25 19,22.16 17.5,20.66 U5.16
SD3  (via drill 0.35)
  Top 0.254: v25,39.25 25,40.75 U1.18 | JP1.17 11.81,18.15 14.29,18.15 U5.17
  Bottom 0.254: v25,39.25 25,36.5 19.75,31.25 19.75,19.8 18.07,18.12 U5.17
SDA  (via drill 0.35)
  Top 0.254: v34.5,52 35,52.5 36.25,52.5 U1.33 | JP2.6 42,46 39.75,46 U5.25 | v50.9,33.85 51.2,34.15 51.2,36.8 52,37.6 CN5.2 52,43.7 48.55,47.15 48.55,79.45 46.9,81.1 26.85,81.1 24.76,83.19 CN10.4
  Bottom 0.254: v34.5,52 38.5,48 38.5,47.25 39.5,46.25 U5.25 | v50.9,33.85 50.9,35 SJ2.3 | CN5.2 48,46 42.25,46 JP2.6
SENSOR_VN
  Top 0.254: U1.5 17.75,53.75 17,53.75 14.5,51.25 U5.4 14.25,51.25 12,51.25 JP1.4
SENSOR_VP
  Top 0.254: U1.4 17.75,55 15.75,55 14.5,53.75 U5.3 14.25,53.75 12,53.75 JP1.3
TTXD
  Top 0.254: TXD.C 5,11.5 3.25,9.75 3.25,9 R4.2
TXD0
  Top 0.254: U1.35 36.25,55 37,55 38.5,53.5 38.5,52.25 39.5,51.25 U5.23 | U3.4 29.82,27.49 29.82,28.22 28.65,29.39 28.65,30.05 29.2,30.6 32.2,30.6 38.5,36.9 38.5,50 39.5,51 U5.23 | JP2.4 42,51.25 39.75,51.25 U5.23
VEE
  Bottom 0.508: SJ3.3 6.5,40.2 5.43,41.27 CN9.1

### Text on the board
tNames: ALGYAN 6th | Designed by Y.Ohe | I2C | I2C/UART2 | DIO(18/19) | DIO(32/33)